# Altium schematic sheet V1.0.SchDoc
size 88 x 27 mm
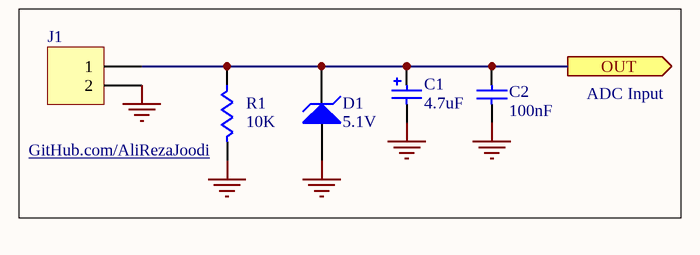
[diagram p0: V1.0.SchDoc]

## Parts
C1  4.7uF  [CAPPR2.5-6.3x5]
C2  100nF  [CAPNTO2.54-3.05x1.78A]
D1  5.1V  [DIODE0.4_Glass]
J1  Header 2  [Fonics_2PIN_1]  (value not drawn)
R1  10K  [AXIAL-0.4]

## Ports
OUT (out)

## Nets
GND: C1.2 C2.1 D1.1(A) J1.2 R1.2
OUT: C1.1 C2.2 D1.2(K) J1.1 R1.1 ; port OUT

## Notes on the sheet
- (near R1) GitHub.com/AliRezaJoodi
- ADC Input

## Library data of the parts
C1 = Cap Pol1: Polarized Capacitor (Radial); Manufacturer: Generic Components; Class I: Passive; Published: 8-Jun-2000; Revision: July-2002: Re-released for DXP Platform.; Publisher: Altium Limited; Class II: Capacitor
C2 = Cap: Capacitor; Manufacturer: Generic Components; Class I: Passive; Published: 8-Jun-2000; Revision: July-2002: Re-released for DXP Platform.; Publisher: Altium Limited; Class II: Capacitor
D1 = D Zener: Zener Diode; Manufacturer: Generic Components; Class I: Discrete; Class II: Diode - Zener; Published: 8-Jun-2000; Revision: July-2002: Re-released for DXP Platform.; Publisher: Altium Limited
J1 = Header 2: Header, 2-Pin; LatestRevisionDate: 17-Jul-2002; LatestRevisionNote: Re-released for DXP Platform.; Publisher: Altium Limited
R1 = Res1: Resistor; Manufacturer: Generic Components; Class I: Passive; Published: 8-Jun-2000; Revision: July-2002: Re-released for DXP Platform.; Publisher: Altium Limited; Class II: Resistor